# Altium project 单车驱动.PrjPcb
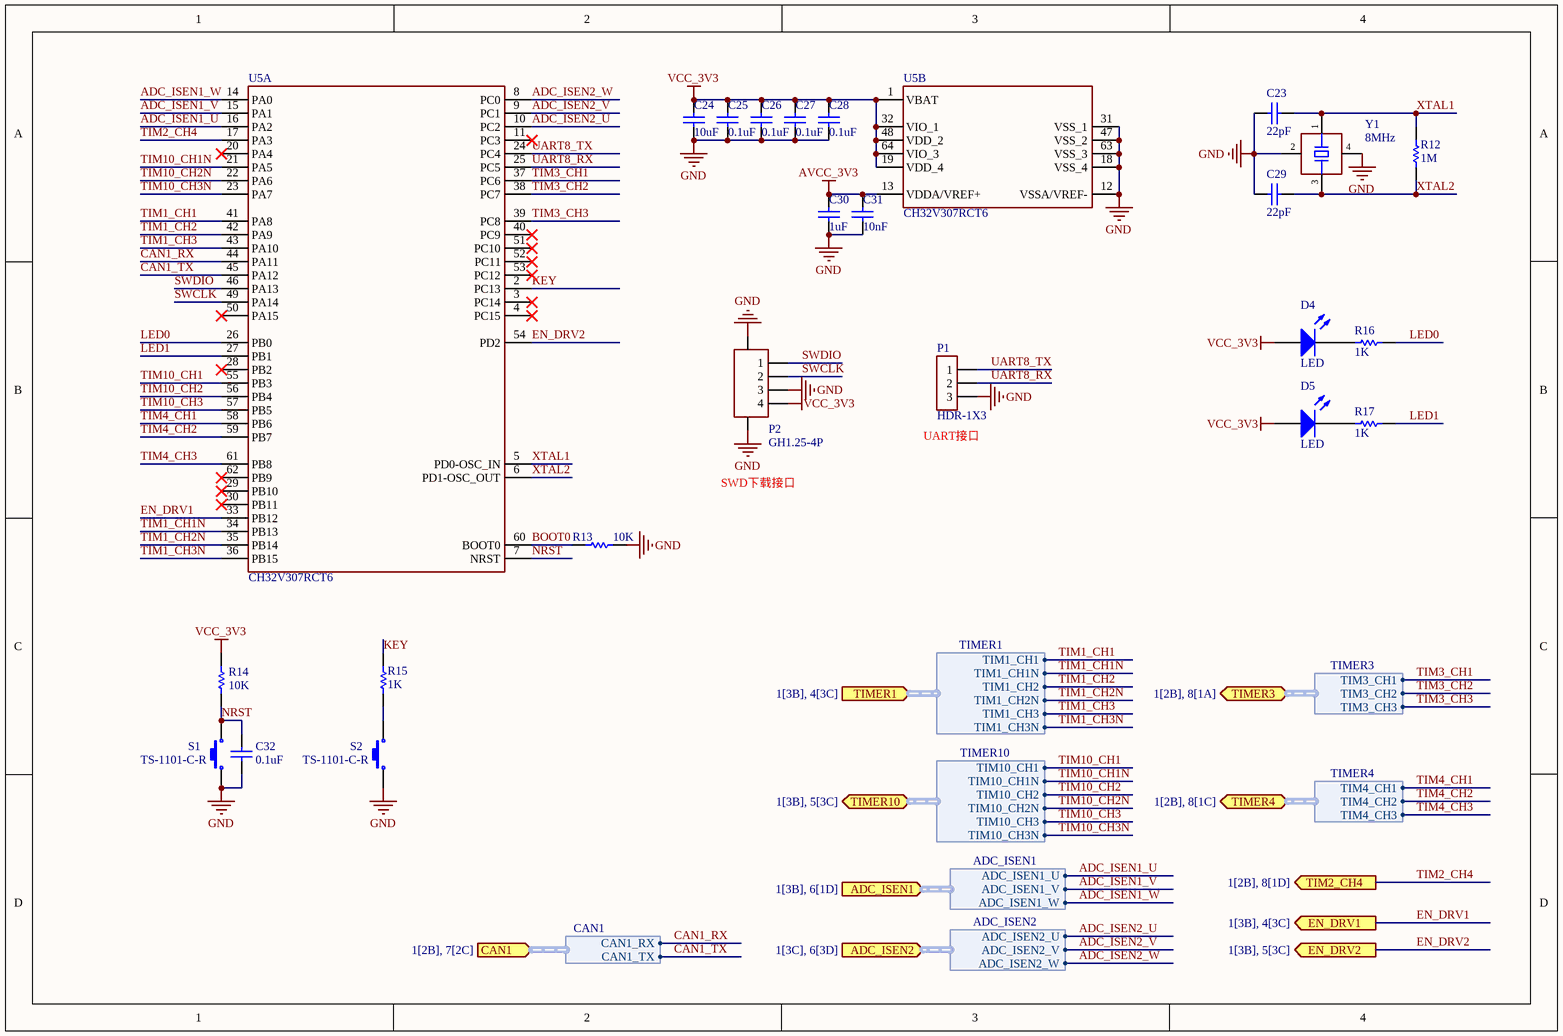
[diagram p0: MCU.SchDoc]
6 sheets, 191 parts. Net scope: flat (ports and power ports of the same name join across sheets).
Board file: PCB1.PcbDoc
Sheets:
  MCU.SchDoc
  Motor_Driver1.SchDoc
  Motor_Driver2.SchDoc
  Current_Sensing.SchDoc
  CAN.SchDoc
  Interface1.SchDoc

## Sheet MCU.SchDoc
size A4; SheetNumber: 3; SheetTotal: 8

### Parts
C23  22pF  [C0603_NS]
C24  10uF  [C0603_NS]
C25  0.1uF  [C0603_NS]
C26  0.1uF  [C0603_NS]
C27  0.1uF  [C0603_NS]
C28  0.1uF  [C0603_NS]
C29  22pF  [C0603_NS]
C30  1uF  [C0603_NS]
C31  10nF  [C0603_NS]
C32  0.1uF  [C0603_NS]
D4  LED  [LED0603_NS]
D5  LED  [LED0603_NS]
P1  HDR-1X3  [HDR2.54-WI-3P]
P2  GH1.25-4P  [A1257WR-S-4P]
R12  1M  [R0603_NS]
R13  10K  [R0603_NS]
R14  10K  [R0603_NS]
R15  1K  [R0603_NS]
R16  1K  [R0603_NS]
R17  1K  [R0603_NS]
S1  TS-1101-C-R  [TS-1101]
S2  TS-1101-C-R  [TS-1101]
U5  CH32V307RCT6  [LQFP64_N]  (parts A,B of 2)
Y1  8MHz  [SMD-3225-4P]

### Ports
ADC_ISEN1 (in, harness ADC_ISEN1, see 1[3B], 6[1D]), ADC_ISEN2 (in, harness ADC_ISEN2, see 1[3C], 6[3D]), CAN1 (in, harness CAN1, see 1[2B], 7[2C]), EN_DRV1 (out, see 1[3B], 4[3C]), EN_DRV2 (out, see 1[3B], 5[3C]), TIM2_CH4 (out, see 1[2B], 8[1D]), TIMER1 (in, harness TIMER1, see 1[3B], 4[3C]), TIMER3 (bidir, harness TIMER3, see 1[2B], 8[1A]), TIMER4 (bidir, harness TIMER4, see 1[2B], 8[1C]), TIMER10 (bidir, harness TIMER10, see 1[3B], 5[3C])

### Harnesses
TIMER1: TIM1_CH1, TIM1_CH2, TIM1_CH3, TIM1_CH1N, TIM1_CH2N, TIM1_CH3N
TIMER10: TIM10_CH1N, TIM10_CH2N, TIM10_CH3N, TIM10_CH1, TIM10_CH2, TIM10_CH3
TIMER4: TIM4_CH1, TIM4_CH2, TIM4_CH3
TIMER3: TIM3_CH1, TIM3_CH2, TIM3_CH3
CAN1: CAN1_RX, CAN1_TX
ADC_ISEN1: ADC_ISEN1_W, ADC_ISEN1_V, ADC_ISEN1_U
ADC_ISEN2: ADC_ISEN2_W, ADC_ISEN2_V, ADC_ISEN2_U

### Nets
AVCC_3V3: C30.2 C31.2 U5.13(VDDA/VREF+)
GND: C23.1 C24.1 C25.1 C26.1 C27.1 C28.1 C29.1 C30.1 C31.1 C32.1 P1.3 P2.0 P2.3 R13.2 S1.1 S2.1 U5.12(VSSA/VREF-) U5.18(VSS_4) U5.31(VSS_1) U5.47(VSS_2) U5.63(VSS_3) Y1.2 Y1.4
VCC_3V3: C24.2 C25.2 C26.2 C27.2 C28.2 D4.1(A) D5.1(A) P2.4 R14.1 U5.1(VBAT) U5.19(VDD_4) U5.32(VIO_1) U5.48(VDD_2) U5.64(VIO_3)
ADC_ISEN1_U: U5.16(PA2) ; port ADC_ISEN1.ADC_ISEN1_U
ADC_ISEN1_V: U5.15(PA1) ; port ADC_ISEN1.ADC_ISEN1_V
ADC_ISEN1_W: U5.14(PA0) ; port ADC_ISEN1.ADC_ISEN1_W
ADC_ISEN2_U: U5.10(PC2) ; port ADC_ISEN2.ADC_ISEN2_U
ADC_ISEN2_V: U5.9(PC1) ; port ADC_ISEN2.ADC_ISEN2_V
ADC_ISEN2_W: U5.8(PC0) ; port ADC_ISEN2.ADC_ISEN2_W
BOOT0: R13.1 U5.60(BOOT0)
CAN1_RX: U5.44(PA11) ; port CAN1.CAN1_RX
CAN1_TX: U5.45(PA12) ; port CAN1.CAN1_TX
EN_DRV1: U5.33(PB12) ; port EN_DRV1
EN_DRV2: U5.54(PD2) ; port EN_DRV2
KEY: R15.2 U5.2(PC13)
LED0: R16.2 U5.26(PB0)
LED1: R17.2 U5.27(PB1)
NRST: C32.2 R14.2 S1.2 U5.7(NRST)
SWCLK: P2.2 U5.49(PA14)
SWDIO: P2.1 U5.46(PA13)
TIM1_CH1: U5.41(PA8) ; port TIMER1.TIM1_CH1
TIM1_CH1N: U5.34(PB13) ; port TIMER1.TIM1_CH1N
TIM1_CH2: U5.42(PA9) ; port TIMER1.TIM1_CH2
TIM1_CH2N: U5.35(PB14) ; port TIMER1.TIM1_CH2N
TIM1_CH3: U5.43(PA10) ; port TIMER1.TIM1_CH3
TIM1_CH3N: U5.36(PB15) ; port TIMER1.TIM1_CH3N
TIM2_CH4: U5.17(PA3) ; port TIM2_CH4
TIM3_CH1: U5.37(PC6) ; port TIMER3.TIM3_CH1
TIM3_CH2: U5.38(PC7) ; port TIMER3.TIM3_CH2
TIM3_CH3: U5.39(PC8) ; port TIMER3.TIM3_CH3
TIM4_CH1: U5.58(PB6) ; port TIMER4.TIM4_CH1
TIM4_CH2: U5.59(PB7) ; port TIMER4.TIM4_CH2
TIM4_CH3: U5.61(PB8) ; port TIMER4.TIM4_CH3
TIM10_CH1: U5.55(PB3) ; port TIMER10.TIM10_CH1
TIM10_CH1N: U5.21(PA5) ; port TIMER10.TIM10_CH1N
TIM10_CH2: U5.56(PB4) ; port TIMER10.TIM10_CH2
TIM10_CH2N: U5.22(PA6) ; port TIMER10.TIM10_CH2N
TIM10_CH3: U5.57(PB5) ; port TIMER10.TIM10_CH3
TIM10_CH3N: U5.23(PA7) ; port TIMER10.TIM10_CH3N
UART8_RX: P1.2 U5.25(PC5)
UART8_TX: P1.1 U5.24(PC4)
XTAL1: C23.2 R12.2 U5.5(PD0-OSC_IN) Y1.1
XTAL2: C29.2 R12.1 U5.6(PD1-OSC_OUT) Y1.3
NetD4_2: D4.2(K) R16.1
NetD5_2: D5.2(K) R17.1
NetR15_1: R15.1 S2.2

Not connected (* = marked no-connect by the designer): U5 3(PC14)* 4(PC15)* 11(PC3)* 20(PA4)* 28(PB2)* 29(PB10)* 30(PB11)* 40(PC9)* 50(PA15)* 51(PC10)* 52(PC11)* 53(PC12)* 62(PB9)*

### Notes on the sheet
- (near P1) UART接口
- SWD下载接口

### Library data of the parts
C23-C32 = Cap: Capacitor
  C23 C29: Published: 8-Jun-2000; LatestRevisionDate: 17-Jul-2002; LatestRevisionNote: Re-released for DXP Platform.; PackageReference: RAD-0.3; Publisher: Altium Limited; PackageDescription: Radial Cap, Thru-Hole; 2 Leads; 0.3 in Pin Spacing; Value: 22pF
D4 D5 = LED0: Typical INFRARED GaAs LED
P2 = Header4
R12-R17 = Res1: Resistor
S1 S2 = SW
Y1 = XTAL

## Sheet Motor_Driver1.SchDoc
size A4; SheetNumber: 4; SheetTotal: 8
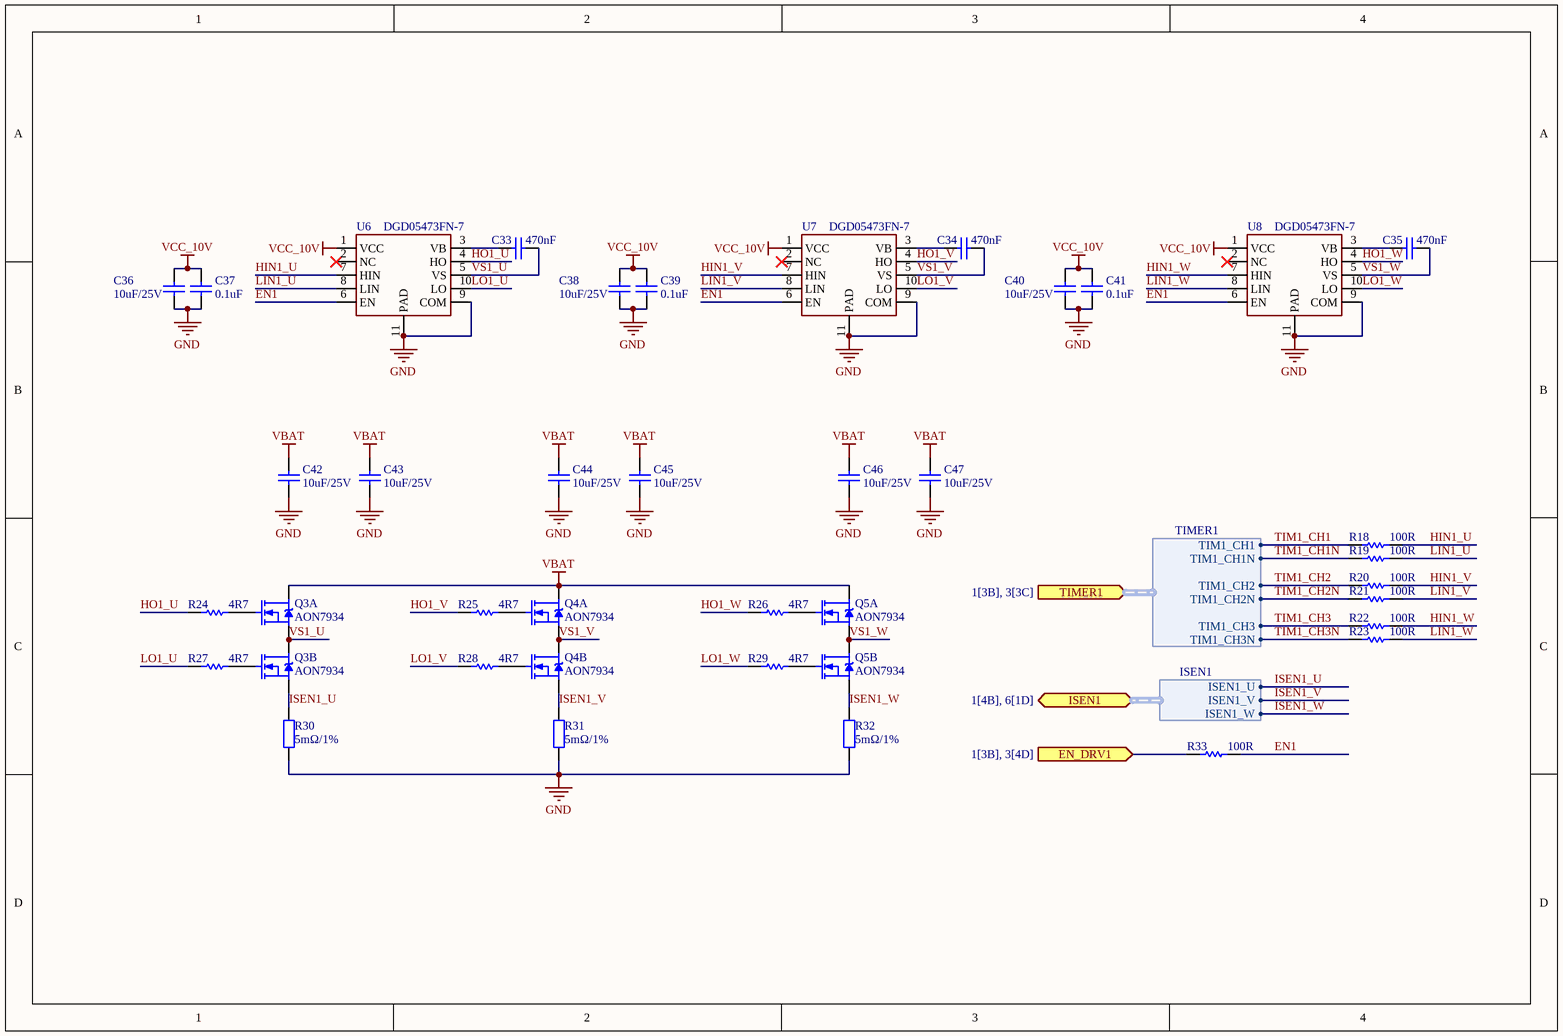
[diagram p1: Motor_Driver1.SchDoc]

### Parts
C33  470nF  [C0603_NS]
C34  470nF  [C0603_NS]
C35  470nF  [C0603_NS]
C36  10uF/25V  [C0603_NS]
C37  0.1uF  [C0603_NS]
C38  10uF/25V  [C0603_NS]
C39  0.1uF  [C0603_NS]
C40  10uF/25V  [C0603_NS]
C41  0.1uF  [C0603_NS]
C42  10uF/25V  [C0603_NS]
C43  10uF/25V  [C0603_NS]
C44  10uF/25V  [C0603_NS]
C45  10uF/25V  [C0603_NS]
C46  10uF/25V  [C0603_NS]
C47  10uF/25V  [C0603_NS]
Q3  AON7934  [POWERPAIR_3X3]  (parts A,B of 2)
Q4  AON7934  [POWERPAIR_3X3]  (parts A,B of 2)
Q5  AON7934  [POWERPAIR_3X3]  (parts A,B of 2)
R18  100R  [R0603_NS]
R19  100R  [R0603_NS]
R20  100R  [R0603_NS]
R21  100R  [R0603_NS]
R22  100R  [R0603_NS]
R23  100R  [R0603_NS]
R24  4R7  [R0603_NS]
R25  4R7  [R0603_NS]
R26  4R7  [R0603_NS]
R27  4R7  [R0603_NS]
R28  4R7  [R0603_NS]
R29  4R7  [R0603_NS]
R30  5mΩ/1%  [R1206_NS]
R31  5mΩ/1%  [R1206_NS]
R32  5mΩ/1%  [R1206_NS]
R33  100R  [R0603_NS]
U6  DGD05473FN-7  [W-DFN3030-10_DGD05473]
U7  DGD05473FN-7  [W-DFN3030-10_DGD05473]
U8  DGD05473FN-7  [W-DFN3030-10_DGD05473]

### Ports
EN_DRV1 (in, see 1[3B], 3[4D]), ISEN1 (bidir, harness ISEN1, see 1[4B], 6[1D]), TIMER1 (in, harness TIMER1, see 1[3B], 3[3C])

### Harnesses
TIMER1: TIM1_CH1, TIM1_CH2, TIM1_CH3, TIM1_CH1N, TIM1_CH2N, TIM1_CH3N
ISEN1: ISEN1_U, ISEN1_V, ISEN1_W

### Nets
GND: C36.2 C37.2 C38.2 C39.2 C40.2 C41.2 C42.1 C43.1 C44.1 C45.1 C46.1 C47.1 R30.1 R31.1 R32.1 U6.9(COM) U6.11(PAD) U7.9(COM) U7.11(PAD) U8.9(COM) U8.11(PAD)
VBAT: C42.2 C43.2 C44.2 C45.2 C46.2 C47.2 Q3.D1 Q4.D1 Q5.D1
VCC_10V: C36.1 C37.1 C38.1 C39.1 C40.1 C41.1 U6.1(VCC) U7.1(VCC) U8.1(VCC)
EN1: R33.2 U6.6(EN) U7.6(EN) U8.6(EN)
EN_DRV1: R33.1 ; port EN_DRV1
HIN1_U: R18.2 U6.7(HIN)
HIN1_V: R20.2 U7.7(HIN)
HIN1_W: R22.2 U8.7(HIN)
HO1_U: R24.1 U6.4(HO)
HO1_V: R25.1 U7.4(HO)
HO1_W: R26.1 U8.4(HO)
ISEN1_U: Q3.S2 R30.2 ; port ISEN1.ISEN1_U
ISEN1_V: Q4.S2 R31.2 ; port ISEN1.ISEN1_V
ISEN1_W: Q5.S2 R32.2 ; port ISEN1.ISEN1_W
LIN1_U: R19.2 U6.8(LIN)
LIN1_V: R21.2 U7.8(LIN)
LIN1_W: R23.2 U8.8(LIN)
LO1_U: R27.1 U6.10(LO)
LO1_V: R28.1 U7.10(LO)
LO1_W: R29.1 U8.10(LO)
TIM1_CH1: R18.1 ; port TIMER1.TIM1_CH1
TIM1_CH1N: R19.1 ; port TIMER1.TIM1_CH1N
TIM1_CH2: R20.1 ; port TIMER1.TIM1_CH2
TIM1_CH2N: R21.1 ; port TIMER1.TIM1_CH2N
TIM1_CH3: R22.1 ; port TIMER1.TIM1_CH3
TIM1_CH3N: R23.1 ; port TIMER1.TIM1_CH3N
VS1_U: C33.2 Q3.S1/D2 U6.5(VS)
VS1_V: C34.2 Q4.S1/D2 U7.5(VS)
VS1_W: C35.2 Q5.S1/D2 U8.5(VS)
NetC33_1: C33.1 U6.3(VB)
NetC34_1: C34.1 U7.3(VB)
NetC35_1: C35.1 U8.3(VB)
NetQ3_G1: Q3.G1 R24.2
NetQ3_G2: Q3.G2 R27.2
NetQ4_G1: Q4.G1 R25.2
NetQ4_G2: Q4.G2 R28.2
NetQ5_G1: Q5.G1 R26.2
NetQ5_G2: Q5.G2 R29.2

Not connected (* = marked no-connect by the designer): U6 2(NC)*; U7 2(NC)*; U8 2(NC)*

### Library data of the parts
C33-C41 = Cap: Capacitor; Value: 1uF; Published: 8-Jun-2000; LatestRevisionDate: 17-Jul-2002; LatestRevisionNote: Re-released for DXP Platform.; PackageReference: RAD-0.3; Publisher: Altium Limited; PackageDescription: Radial Cap, Thru-Hole; 2 Leads; 0.3 in Pin Spacing
C42-C47 = Cap: Capacitor
R18-R29 R33 = Res1: Resistor
R30-R32 = Res2: Resistor; Value: 15mΩ; Published: 8-Jun-2000; LatestRevisionDate: 17-Jul-2002; LatestRevisionNote: Re-released for DXP Platform.; PackageReference: AXIAL-0.4; Publisher: Altium Limited; PackageDescription: Axial Device, Thru-Hole; 2 Leads; 0.4 in Pin Spacing
U6-U8 = DGD05473

## Sheet Motor_Driver2.SchDoc
size A4; SheetNumber: 5; SheetTotal: 8
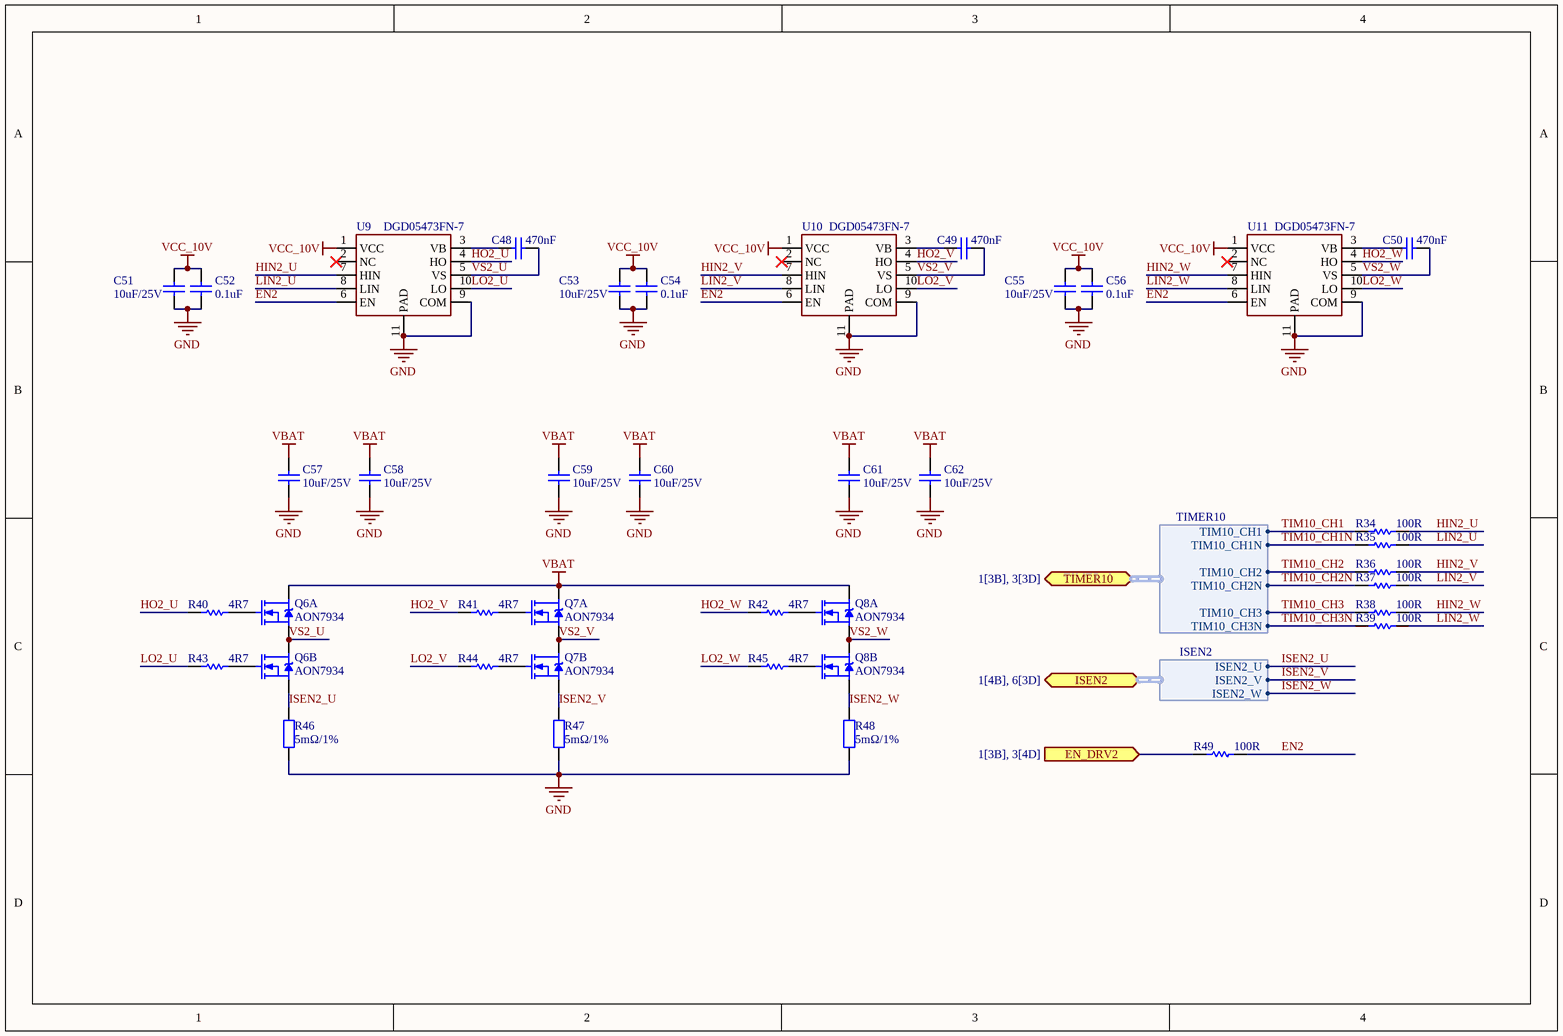
[diagram p2: Motor_Driver2.SchDoc]

### Parts
C48  470nF  [C0603_NS]
C49  470nF  [C0603_NS]
C50  470nF  [C0603_NS]
C51  10uF/25V  [C0603_NS]
C52  0.1uF  [C0603_NS]
C53  10uF/25V  [C0603_NS]
C54  0.1uF  [C0603_NS]
C55  10uF/25V  [C0603_NS]
C56  0.1uF  [C0603_NS]
C57  10uF/25V  [C0603_NS]
C58  10uF/25V  [C0603_NS]
C59  10uF/25V  [C0603_NS]
C60  10uF/25V  [C0603_NS]
C61  10uF/25V  [C0603_NS]
C62  10uF/25V  [C0603_NS]
Q6  AON7934  [POWERPAIR_3X3]  (parts A,B of 2)
Q7  AON7934  [POWERPAIR_3X3]  (parts A,B of 2)
Q8  AON7934  [POWERPAIR_3X3]  (parts A,B of 2)
R34  100R  [R0603_NS]
R35  100R  [R0603_NS]
R36  100R  [R0603_NS]
R37  100R  [R0603_NS]
R38  100R  [R0603_NS]
R39  100R  [R0603_NS]
R40  4R7  [R0603_NS]
R41  4R7  [R0603_NS]
R42  4R7  [R0603_NS]
R43  4R7  [R0603_NS]
R44  4R7  [R0603_NS]
R45  4R7  [R0603_NS]
R46  5mΩ/1%  [R1206_NS]
R47  5mΩ/1%  [R1206_NS]
R48  5mΩ/1%  [R1206_NS]
R49  100R  [R0603_NS]
U9  DGD05473FN-7  [W-DFN3030-10_DGD05473]
U10  DGD05473FN-7  [W-DFN3030-10_DGD05473]
U11  DGD05473FN-7  [W-DFN3030-10_DGD05473]

### Ports
EN_DRV2 (in, see 1[3B], 3[4D]), ISEN2 (bidir, harness ISEN2, see 1[4B], 6[3D]), TIMER10 (bidir, harness TIMER10, see 1[3B], 3[3D])

### Harnesses
TIMER10: TIM10_CH1N, TIM10_CH2N, TIM10_CH3N, TIM10_CH1, TIM10_CH2, TIM10_CH3
ISEN2: ISEN2_U, ISEN2_V, ISEN2_W

### Nets
GND: C51.2 C52.2 C53.2 C54.2 C55.2 C56.2 C57.1 C58.1 C59.1 C60.1 C61.1 C62.1 R46.1 R47.1 R48.1 U9.9(COM) U9.11(PAD) U10.9(COM) U10.11(PAD) U11.9(COM) U11.11(PAD)
VBAT: C57.2 C58.2 C59.2 C60.2 C61.2 C62.2 Q6.D1 Q7.D1 Q8.D1
VCC_10V: C51.1 C52.1 C53.1 C54.1 C55.1 C56.1 U9.1(VCC) U10.1(VCC) U11.1(VCC)
EN2: R49.2 U9.6(EN) U10.6(EN) U11.6(EN)
EN_DRV2: R49.1 ; port EN_DRV2
HIN2_U: R34.2 U9.7(HIN)
HIN2_V: R36.2 U10.7(HIN)
HIN2_W: R38.2 U11.7(HIN)
HO2_U: R40.1 U9.4(HO)
HO2_V: R41.1 U10.4(HO)
HO2_W: R42.1 U11.4(HO)
ISEN2_U: Q6.S2 R46.2 ; port ISEN2.ISEN2_U
ISEN2_V: Q7.S2 R47.2 ; port ISEN2.ISEN2_V
ISEN2_W: Q8.S2 R48.2 ; port ISEN2.ISEN2_W
LIN2_U: R35.2 U9.8(LIN)
LIN2_V: R37.2 U10.8(LIN)
LIN2_W: R39.2 U11.8(LIN)
LO2_U: R43.1 U9.10(LO)
LO2_V: R44.1 U10.10(LO)
LO2_W: R45.1 U11.10(LO)
TIM10_CH1: R34.1 ; port TIMER10.TIM10_CH1
TIM10_CH1N: R35.1 ; port TIMER10.TIM10_CH1N
TIM10_CH2: R36.1 ; port TIMER10.TIM10_CH2
TIM10_CH2N: R37.1 ; port TIMER10.TIM10_CH2N
TIM10_CH3: R38.1 ; port TIMER10.TIM10_CH3
TIM10_CH3N: R39.1 ; port TIMER10.TIM10_CH3N
VS2_U: C48.2 Q6.S1/D2 U9.5(VS)
VS2_V: C49.2 Q7.S1/D2 U10.5(VS)
VS2_W: C50.2 Q8.S1/D2 U11.5(VS)
NetC48_1: C48.1 U9.3(VB)
NetC49_1: C49.1 U10.3(VB)
NetC50_1: C50.1 U11.3(VB)
NetQ6_G1: Q6.G1 R40.2
NetQ6_G2: Q6.G2 R43.2
NetQ7_G1: Q7.G1 R41.2
NetQ7_G2: Q7.G2 R44.2
NetQ8_G1: Q8.G1 R42.2
NetQ8_G2: Q8.G2 R45.2

Not connected (* = marked no-connect by the designer): U9 2(NC)*; U10 2(NC)*; U11 2(NC)*

### Library data of the parts
C48-C56 = Cap: Capacitor; Value: 1uF; Published: 8-Jun-2000; LatestRevisionDate: 17-Jul-2002; LatestRevisionNote: Re-released for DXP Platform.; PackageReference: RAD-0.3; Publisher: Altium Limited; PackageDescription: Radial Cap, Thru-Hole; 2 Leads; 0.3 in Pin Spacing
C57-C62 = Cap: Capacitor
R34-R45 R49 = Res1: Resistor
R46-R48 = Res2: Resistor; Value: 15mΩ; Published: 8-Jun-2000; LatestRevisionDate: 17-Jul-2002; LatestRevisionNote: Re-released for DXP Platform.; PackageReference: AXIAL-0.4; Publisher: Altium Limited; PackageDescription: Axial Device, Thru-Hole; 2 Leads; 0.4 in Pin Spacing
U9-U11 = DGD05473

## Sheet Current_Sensing.SchDoc
size A4; SheetNumber: 6; SheetTotal: 8
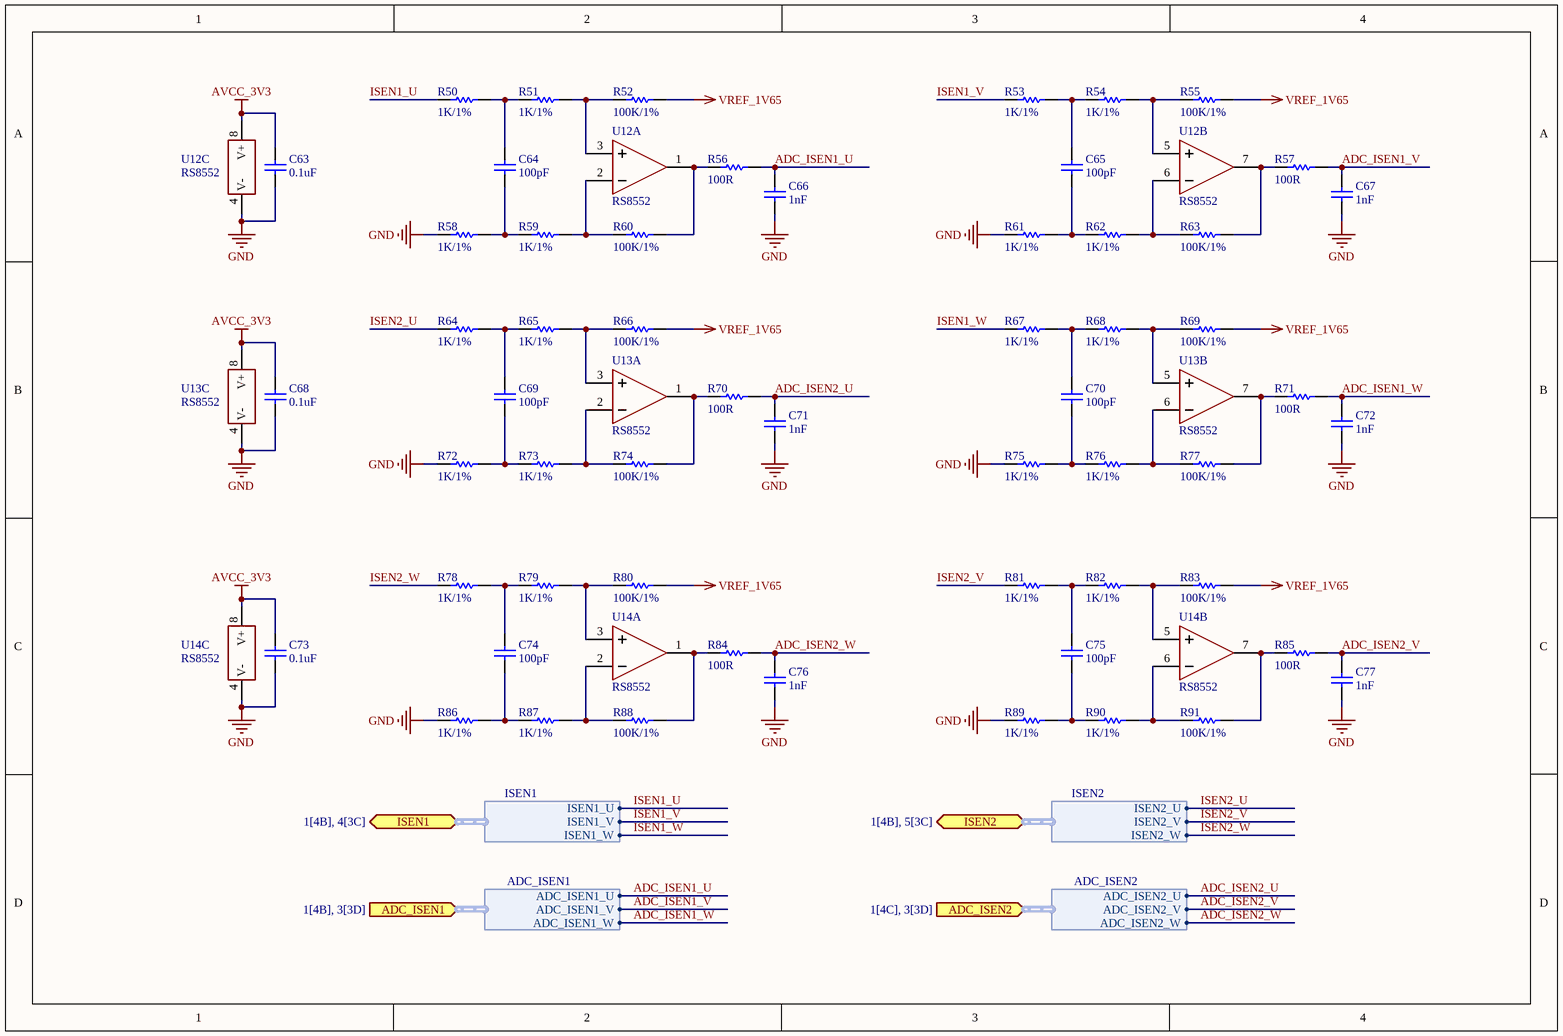
[diagram p3: Current_Sensing.SchDoc]

### Parts
C63  0.1uF  [C0603_NS]
C64  100pF  [C0603_NS]
C65  100pF  [C0603_NS]
C66  1nF  [C0603_NS]
C67  1nF  [C0603_NS]
C68  0.1uF  [C0603_NS]
C69  100pF  [C0603_NS]
C70  100pF  [C0603_NS]
C71  1nF  [C0603_NS]
C72  1nF  [C0603_NS]
C73  0.1uF  [C0603_NS]
C74  100pF  [C0603_NS]
C75  100pF  [C0603_NS]
C76  1nF  [C0603_NS]
C77  1nF  [C0603_NS]
R50  1K/1%  [R0603_NS]
R51  1K/1%  [R0603_NS]
R52  100K/1%  [R0603_NS]
R53  1K/1%  [R0603_NS]
R54  1K/1%  [R0603_NS]
R55  100K/1%  [R0603_NS]
R56  100R  [R0603_NS]
R57  100R  [R0603_NS]
R58  1K/1%  [R0603_NS]
R59  1K/1%  [R0603_NS]
R60  100K/1%  [R0603_NS]
R61  1K/1%  [R0603_NS]
R62  1K/1%  [R0603_NS]
R63  100K/1%  [R0603_NS]
R64  1K/1%  [R0603_NS]
R65  1K/1%  [R0603_NS]
R66  100K/1%  [R0603_NS]
R67  1K/1%  [R0603_NS]
R68  1K/1%  [R0603_NS]
R69  100K/1%  [R0603_NS]
R70  100R  [R0603_NS]
R71  100R  [R0603_NS]
R72  1K/1%  [R0603_NS]
R73  1K/1%  [R0603_NS]
R74  100K/1%  [R0603_NS]
R75  1K/1%  [R0603_NS]
R76  1K/1%  [R0603_NS]
R77  100K/1%  [R0603_NS]
R78  1K/1%  [R0603_NS]
R79  1K/1%  [R0603_NS]
R80  100K/1%  [R0603_NS]
R81  1K/1%  [R0603_NS]
R82  1K/1%  [R0603_NS]
R83  100K/1%  [R0603_NS]
R84  100R  [R0603_NS]
R85  100R  [R0603_NS]
R86  1K/1%  [R0603_NS]
R87  1K/1%  [R0603_NS]
R88  100K/1%  [R0603_NS]
R89  1K/1%  [R0603_NS]
R90  1K/1%  [R0603_NS]
R91  100K/1%  [R0603_NS]
U12  RS8552  [MSOP8]  (parts A,B,C of 3)
U13  RS8552  [MSOP8]  (parts A,B,C of 3)
U14  RS8552  [MSOP8]  (parts A,B,C of 3)

### Ports
ADC_ISEN1 (in, harness ADC_ISEN1, see 1[4B], 3[3D]), ADC_ISEN2 (in, harness ADC_ISEN2, see 1[4C], 3[3D]), ISEN1 (bidir, harness ISEN1, see 1[4B], 4[3C]), ISEN2 (bidir, harness ISEN2, see 1[4B], 5[3C])

### Harnesses
ISEN1: ISEN1_U, ISEN1_V, ISEN1_W
ISEN2: ISEN2_U, ISEN2_V, ISEN2_W
ADC_ISEN1: ADC_ISEN1_W, ADC_ISEN1_V, ADC_ISEN1_U
ADC_ISEN2: ADC_ISEN2_W, ADC_ISEN2_V, ADC_ISEN2_U

### Nets
AVCC_3V3: C63.2 C68.2 C73.2 U12.8(V+) U13.8(V+) U14.8(V+)
GND: C63.1 C66.1 C67.1 C68.1 C71.1 C72.1 C73.1 C76.1 C77.1 R58.1 R61.1 R72.1 R75.1 R86.1 R89.1 U12.4(V-) U13.4(V-) U14.4(V-)
VREF_1V65: R52.2 R55.2 R66.2 R69.2 R80.2 R83.2
ADC_ISEN1_U: C66.2 R56.2 ; port ADC_ISEN1.ADC_ISEN1_U
ADC_ISEN1_V: C67.2 R57.2 ; port ADC_ISEN1.ADC_ISEN1_V
ADC_ISEN1_W: C72.2 R71.2 ; port ADC_ISEN1.ADC_ISEN1_W
ADC_ISEN2_U: C71.2 R70.2 ; port ADC_ISEN2.ADC_ISEN2_U
ADC_ISEN2_V: C77.2 R85.2 ; port ADC_ISEN2.ADC_ISEN2_V
ADC_ISEN2_W: C76.2 R84.2 ; port ADC_ISEN2.ADC_ISEN2_W
ISEN1_U: R50.1 ; port ISEN1.ISEN1_U
ISEN1_V: R53.1 ; port ISEN1.ISEN1_V
ISEN1_W: R67.1 ; port ISEN1.ISEN1_W
ISEN2_U: R64.1 ; port ISEN2.ISEN2_U
ISEN2_V: R81.1 ; port ISEN2.ISEN2_V
ISEN2_W: R78.1 ; port ISEN2.ISEN2_W
NetC64_1: C64.1 R58.2 R59.1
NetC64_2: C64.2 R50.2 R51.1
NetC65_1: C65.1 R61.2 R62.1
NetC65_2: C65.2 R53.2 R54.1
NetC69_1: C69.1 R72.2 R73.1
NetC69_2: C69.2 R64.2 R65.1
NetC70_1: C70.1 R75.2 R76.1
NetC70_2: C70.2 R67.2 R68.1
NetC74_1: C74.1 R86.2 R87.1
NetC74_2: C74.2 R78.2 R79.1
NetC75_1: C75.1 R89.2 R90.1
NetC75_2: C75.2 R81.2 R82.1
NetR51_2: R51.2 R52.1 U12.3(+IN_A)
NetR54_2: R54.2 R55.1 U12.5(+IN_B)
NetR56_1: R56.1 R60.2 U12.1(OUT_A)
NetR57_1: R57.1 R63.2 U12.7(OUT_B)
NetR59_2: R59.2 R60.1 U12.2(-IN_A)
NetR62_2: R62.2 R63.1 U12.6(-IN_B)
NetR65_2: R65.2 R66.1 U13.3(+IN_A)
NetR68_2: R68.2 R69.1 U13.5(+IN_B)
NetR70_1: R70.1 R74.2 U13.1(OUT_A)
NetR71_1: R71.1 R77.2 U13.7(OUT_B)
NetR73_2: R73.2 R74.1 U13.2(-IN_A)
NetR76_2: R76.2 R77.1 U13.6(-IN_B)
NetR79_2: R79.2 R80.1 U14.3(+IN_A)
NetR82_2: R82.2 R83.1 U14.5(+IN_B)
NetR84_1: R84.1 R88.2 U14.1(OUT_A)
NetR85_1: R85.1 R91.2 U14.7(OUT_B)
NetR87_2: R87.2 R88.1 U14.2(-IN_A)
NetR90_2: R90.2 R91.1 U14.6(-IN_B)

### Library data of the parts
C63-C77 = Cap: Capacitor
R50-R91 = Res1: Resistor
U12-U14 = AD8606

## Sheet CAN.SchDoc
size A4; SheetNumber: 7; SheetTotal: 8
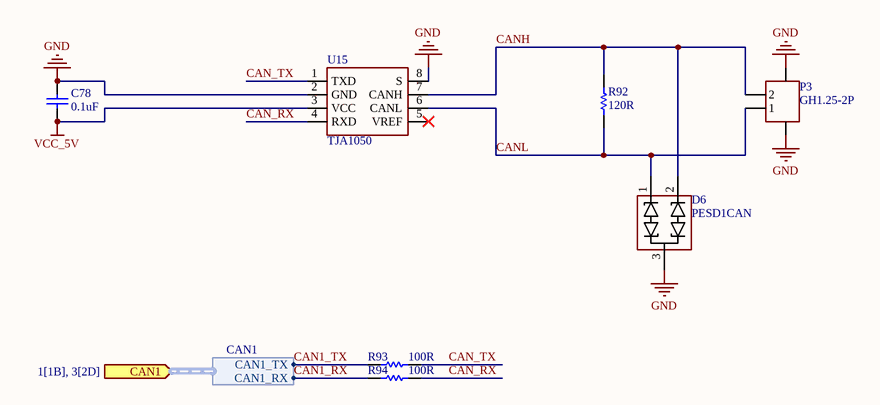
[diagram p4: CAN.SchDoc]

### Parts
C78  0.1uF  [C0603_NS]
D6  PESD1CAN  [SOT23-3N]
P3  GH1.25-2P  [A1257WR-S-2P]
R92  120R  [R0603_NS]
R93  100R  [R0603_NS]
R94  100R  [R0603_NS]
U15  TJA1050  [SOP8_N]

### Ports
CAN1 (in, harness CAN1, see 1[1B], 3[2D])

### Harnesses
CAN1: CAN1_RX, CAN1_TX

### Nets
GND: C78.2 D6.3 P3.0 U15.2(GND) U15.8(S)
VCC_5V: C78.1 U15.3(VCC)
CAN1_RX: R94.1 ; port CAN1.CAN1_RX
CAN1_TX: R93.1 ; port CAN1.CAN1_TX
CAN_RX: R94.2 U15.4(RXD)
CAN_TX: R93.2 U15.1(TXD)
CANH: D6.2 P3.2 R92.2 U15.7(CANH)
CANL: D6.1 P3.1 R92.1 U15.6(CANL)

Not connected (* = marked no-connect by the designer): U15 5(VREF)*

### Library data of the parts
C78 = Cap: Capacitor
P3 = Header2
R92-R94 = Res1: Resistor

## Sheet Interface1.SchDoc
size A4; SheetNumber: 8; SheetTotal: 8
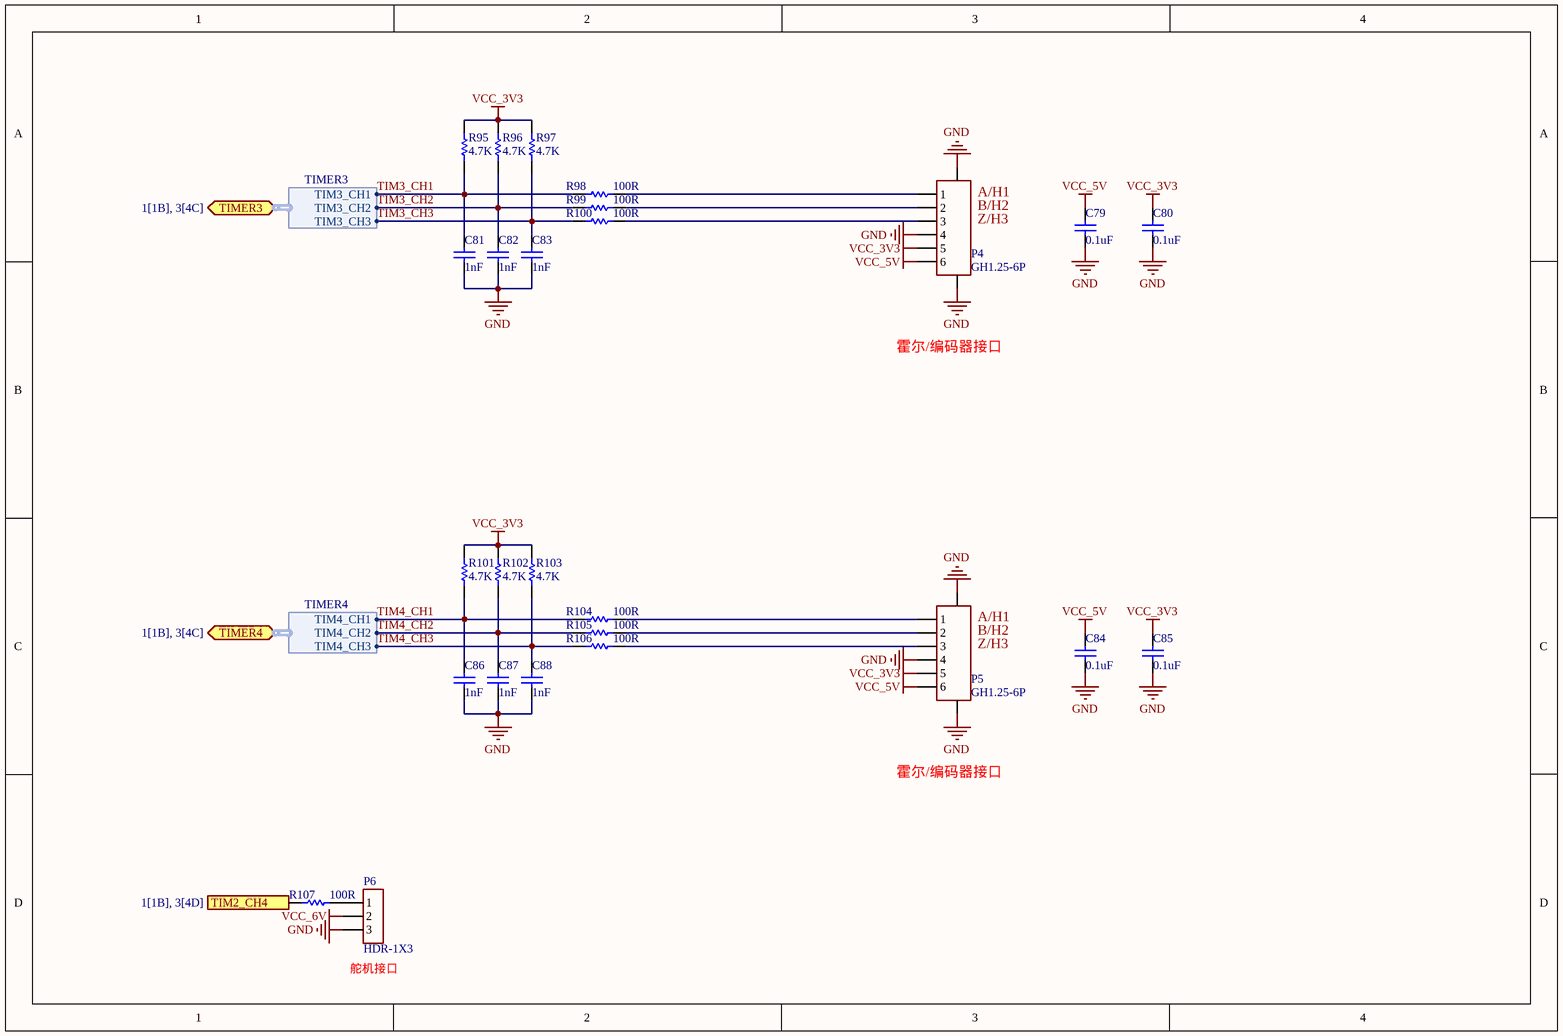
[diagram p5: Interface1.SchDoc]

### Parts
C79  0.1uF  [C0603_NS]
C80  0.1uF  [C0603_NS]
C81  1nF  [C0603_NS]
C82  1nF  [C0603_NS]
C83  1nF  [C0603_NS]
C84  0.1uF  [C0603_NS]
C85  0.1uF  [C0603_NS]
C86  1nF  [C0603_NS]
C87  1nF  [C0603_NS]
C88  1nF  [C0603_NS]
P4  GH1.25-6P  [A1257WR-S-6P]
P5  GH1.25-6P  [A1257WR-S-6P]
P6  HDR-1X3  [HDR2.54-WI-3P]
R95  4.7K  [R0603_NS]
R96  4.7K  [R0603_NS]
R97  4.7K  [R0603_NS]
R98  100R  [R0603_NS]
R99  100R  [R0603_NS]
R100  100R  [R0603_NS]
R101  4.7K  [R0603_NS]
R102  4.7K  [R0603_NS]
R103  4.7K  [R0603_NS]
R104  100R  [R0603_NS]
R105  100R  [R0603_NS]
R106  100R  [R0603_NS]
R107  100R  [R0603_NS]

### Ports
TIM2_CH4 (in, see 1[1B], 3[4D]), TIMER3 (bidir, harness TIMER3, see 1[1B], 3[4C]), TIMER4 (bidir, harness TIMER4, see 1[1B], 3[4C])

### Harnesses
TIMER4: TIM4_CH1, TIM4_CH2, TIM4_CH3
TIMER3: TIM3_CH1, TIM3_CH2, TIM3_CH3

### Nets
GND: C79.1 C80.1 C81.1 C82.1 C83.1 C84.1 C85.1 C86.1 C87.1 C88.1 P4.0 P4.4 P5.0 P5.4 P6.3
VCC_3V3: C80.2 C85.2 P4.5 P5.5 R95.2 R96.2 R97.2 R101.2 R102.2 R103.2
VCC_5V: C79.2 C84.2 P4.6 P5.6
VCC_6V: P6.2
TIM2_CH4: R107.1 ; port TIM2_CH4
TIM3_CH1: C81.2 R95.1 R98.1 ; port TIMER3.TIM3_CH1
TIM3_CH2: C82.2 R96.1 R99.1 ; port TIMER3.TIM3_CH2
TIM3_CH3: C83.2 R97.1 R100.1 ; port TIMER3.TIM3_CH3
TIM4_CH1: C86.2 R101.1 R104.1 ; port TIMER4.TIM4_CH1
TIM4_CH2: C87.2 R102.1 R105.1 ; port TIMER4.TIM4_CH2
TIM4_CH3: C88.2 R103.1 R106.1 ; port TIMER4.TIM4_CH3
NetP4_1: P4.1 R98.2
NetP4_2: P4.2 R99.2
NetP4_3: P4.3 R100.2
NetP5_1: P5.1 R104.2
NetP5_2: P5.2 R105.2
NetP5_3: P5.3 R106.2
NetP6_1: P6.1 R107.2

### Notes on the sheet
- (near P4) A/H1
- (near P4) B/H2
- (near P4) Z/H3
- 霍尔/编码器接口
- (near P5) A/H1
- (near P5) B/H2
- (near P5) Z/H3
- (near P6) 舵机接口

### Library data of the parts
C79-C88 = Cap: Capacitor
P4 P5 = Header6
R95-R107 = Res1: Resistor

## Nets that join several sheets
AVCC_3V3: MCU (C30.2 C31.2 U5.13), Current_Sensing (6 pins)
GND: MCU (23 pins), Motor_Driver1 (21 pins), Motor_Driver2 (21 pins), Current_Sensing (18 pins), CAN (5 pins), Interface1 (15 pins)
VBAT: Motor_Driver1 (9 pins), Motor_Driver2 (9 pins)
VCC_3V3: MCU (14 pins), Interface1 (10 pins)
VCC_5V: CAN (C78.1 U15.3), Interface1 (C79.2 C84.2 P4.6 P5.6)
VCC_10V: Motor_Driver1 (9 pins), Motor_Driver2 (9 pins)
ADC_ISEN1_U: MCU (U5.16), Current_Sensing (C66.2 R56.2)
ADC_ISEN1_V: MCU (U5.15), Current_Sensing (C67.2 R57.2)
ADC_ISEN1_W: MCU (U5.14), Current_Sensing (C72.2 R71.2)
ADC_ISEN2_U: MCU (U5.10), Current_Sensing (C71.2 R70.2)
ADC_ISEN2_V: MCU (U5.9), Current_Sensing (C77.2 R85.2)
ADC_ISEN2_W: MCU (U5.8), Current_Sensing (C76.2 R84.2)
CAN1_RX: MCU (U5.44), CAN (R94.1)
CAN1_TX: MCU (U5.45), CAN (R93.1)
EN_DRV1: MCU (U5.33), Motor_Driver1 (R33.1)
EN_DRV2: MCU (U5.54), Motor_Driver2 (R49.1)
ISEN1_U: Motor_Driver1 (Q3.S2 R30.2), Current_Sensing (R50.1)
ISEN1_V: Motor_Driver1 (Q4.S2 R31.2), Current_Sensing (R53.1)
ISEN1_W: Motor_Driver1 (Q5.S2 R32.2), Current_Sensing (R67.1)
ISEN2_U: Motor_Driver2 (Q6.S2 R46.2), Current_Sensing (R64.1)
ISEN2_V: Motor_Driver2 (Q7.S2 R47.2), Current_Sensing (R81.1)
ISEN2_W: Motor_Driver2 (Q8.S2 R48.2), Current_Sensing (R78.1)
TIM1_CH1: MCU (U5.41), Motor_Driver1 (R18.1)
TIM1_CH1N: MCU (U5.34), Motor_Driver1 (R19.1)
TIM1_CH2: MCU (U5.42), Motor_Driver1 (R20.1)
TIM1_CH2N: MCU (U5.35), Motor_Driver1 (R21.1)
TIM1_CH3: MCU (U5.43), Motor_Driver1 (R22.1)
TIM1_CH3N: MCU (U5.36), Motor_Driver1 (R23.1)
TIM2_CH4: MCU (U5.17), Interface1 (R107.1)
TIM3_CH1: MCU (U5.37), Interface1 (C81.2 R95.1 R98.1)
TIM3_CH2: MCU (U5.38), Interface1 (C82.2 R96.1 R99.1)
TIM3_CH3: MCU (U5.39), Interface1 (C83.2 R97.1 R100.1)
TIM4_CH1: MCU (U5.58), Interface1 (C86.2 R101.1 R104.1)
TIM4_CH2: MCU (U5.59), Interface1 (C87.2 R102.1 R105.1)
TIM4_CH3: MCU (U5.61), Interface1 (C88.2 R103.1 R106.1)
TIM10_CH1: MCU (U5.55), Motor_Driver2 (R34.1)
TIM10_CH1N: MCU (U5.21), Motor_Driver2 (R35.1)
TIM10_CH2: MCU (U5.56), Motor_Driver2 (R36.1)
TIM10_CH2N: MCU (U5.22), Motor_Driver2 (R37.1)
TIM10_CH3: MCU (U5.57), Motor_Driver2 (R38.1)
TIM10_CH3N: MCU (U5.23), Motor_Driver2 (R39.1)